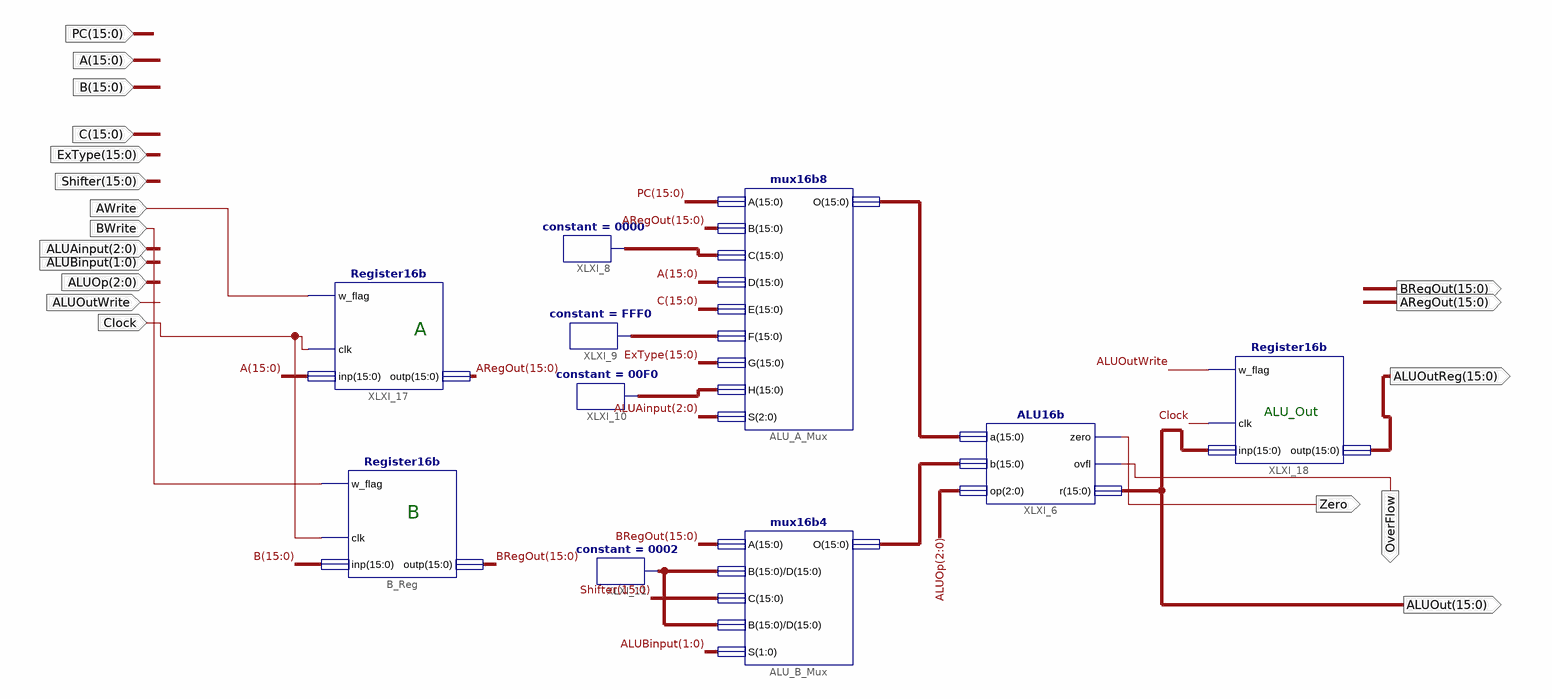
[diagram p0: schematic sheet 1]
// Xilinx ISE schematic A_B_and_ALU.sch (artix7) as structural Verilog: 10 symbols, 19 ports
module A_B_and_ALU (
  input  [15:0] PC,
  input  [15:0] A,
  input  [15:0] B,
  input  [15:0] C,
  input  [15:0] ExType,
  input  [15:0] Shifter,
  input  AWrite,
  input  [2:0] ALUAinput,
  input  [1:0] ALUBinput,
  input  [2:0] ALUOp,
  input  BWrite,
  input  ALUOutWrite,
  input  Clock,
  output [15:0] ALUOut,
  output [15:0] ALUOutReg,
  output Zero,
  output OverFlow,
  output [15:0] ARegOut,
  output [15:0] BRegOut
);

  wire [15:0] XLXN_66, XLXN_67, XLXN_73, XLXN_76, XLXN_78, XLXN_80;

  mux16b8 ALU_A_Mux (
    .A(PC), .B(ARegOut), .C(XLXN_73), .D(A), .E(C), .F(XLXN_76), .G(ExType), .H(XLXN_78), .S(ALUAinput),
    .O(XLXN_66));
  mux16b4 ALU_B_Mux (.A(BRegOut), .B(XLXN_80), .C(Shifter), .D(XLXN_80), .S(ALUBinput), .O(XLXN_67));
  ALU16b XLXI_6 (.a(XLXN_66), .b(XLXN_67), .op(ALUOp), .zero(Zero), .ovfl(OverFlow), .r(ALUOut));
  constant #(.CValue("0000")) XLXI_8 (.O(XLXN_73));
  constant #(.CValue("FFF0")) XLXI_9 (.O(XLXN_76));
  constant #(.CValue("00F0")) XLXI_10 (.O(XLXN_78));
  constant #(.CValue("0002")) XLXI_11 (.O(XLXN_80));
  Register16b XLXI_18 (.w_flag(ALUOutWrite), .clk(Clock), .inp(ALUOut), .outp(ALUOutReg));
  Register16b B_Reg (.w_flag(BWrite), .clk(Clock), .inp(B), .outp(BRegOut));
  Register16b XLXI_17 (.w_flag(AWrite), .clk(Clock), .inp(A), .outp(ARegOut));

  // Notes on the sheet:
  //   A
  //   ALU_Out
  //   B
endmodule
